# Altium schematic sheet OpAmpSupply.SchDoc
size Legal; CompanyName: Ploopy Corporation; Organization: Ploopy Corporation; Address1: Suite 226, 137-1140 Burnhamthorpe Road W; Address2: Mississauga; Address3: Ontario; Address4: Canada L5C 0A3; DocumentNumber: 7; Revision: R1.007; SheetNumber: 7; SheetTotal: 11
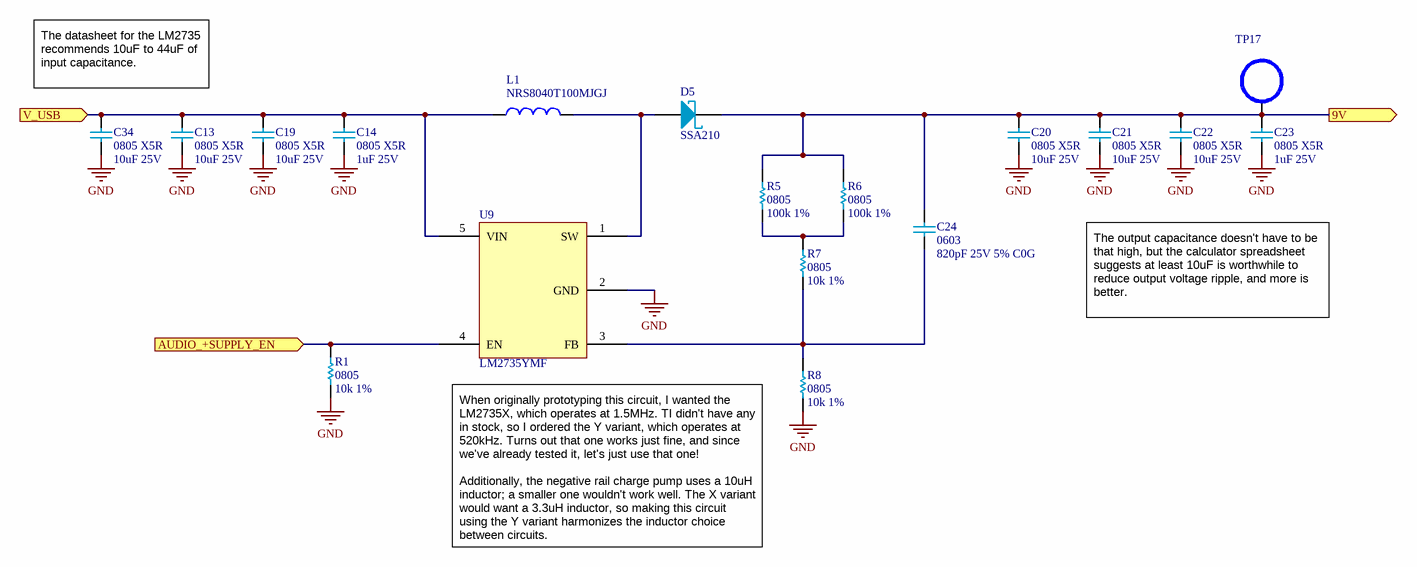
[diagram p0: OpAmpSupply.SchDoc]

## Parts
C13  0805 X5R  value 10uF 25V  [0805 - TALL]
C14  0805 X5R  value 1uF 25V  [0805 - TALL]
C19  0805 X5R  value 10uF 25V  [0805 - TALL]
C20  0805 X5R  value 10uF 25V  [0805 - TALL]
C21  0805 X5R  value 10uF 25V  [0805 - TALL]
C22  0805 X5R  value 10uF 25V  [0805 - TALL]
C23  0805 X5R  value 1uF 25V  [0805 - TALL]
C24  0603  value 820pF 25V 5% C0G  [0603]
C34  0805 X5R  value 10uF 25V  [0805 - TALL]
D5  SSA210  [SSA210 - DO-214AC]
L1  NRS8040T100MJGJ  [NRS8040T100MJGJ]
R1  0805  value 10k 1%  [0805]
R5  0805  value 100k 1%  [0805]
R6  0805  value 100k 1%  [0805]
R7  0805  value 10k 1%  [0805]
R8  0805  value 10k 1%  [0805]
TP17  TestPointHook  [S2751-46R]  (value not drawn)
U9  LM2735YMF  [LM2735XMF - SOT95P280X145-5M]

## Ports
9V (out), AUDIO_+SUPPLY_EN (in), V_USB (in)

## Nets
GND: C13.1 C14.1 C19.1 C20.1 C21.1 C22.1 C23.1 C34.1 R1.1 R8.1 U9.2(GND)
9V: C20.2 C21.2 C22.2 C23.2 C24.2 D5.1(C) R5.2 R6.2 TP17.1 ; port 9V
AUDIO_+SUPPLY_EN: R1.2 U9.4(EN) ; port AUDIO_+SUPPLY_EN
V_USB: C13.2 C14.2 C19.2 C34.2 L1.1 U9.5(VIN) ; port V_USB
NetC24_1: C24.1 R7.1 R8.2 U9.3(FB)
NetD5_2: D5.2 L1.2 U9.1(SW)
NetR5_1: R5.1 R6.1 R7.2

## Notes on the sheet
- The datasheet for the LM2735 recommends 10uF to 44uF of input capacitance.
- The output capacitance doesn't have to be that high, but the calculator spreadsheet suggests at least 10uF is worthwhile to reduce output voltage ripple, and more is better.
- When originally prototyping this circuit, I wanted the LM2735X, which operates at 1.5MHz. TI didn't have any in stock, so I ordered the Y variant, which operates at 520kHz. Turns out that one works just fine, and since we've already tested it, let's just use that one!
  Additionally, the negative rail charge pump uses a 10uH inductor; a smaller one wouldn't work well. The X variant would want a 3.3uH inductor, so making this circuit using the Y variant harmonizes the inductor choice between circuits.
- Copyright Ploopy Corporation 2023
- Licensed under the CERN-OHL-S v2
- http://ohwr.org/cernohl
- Title:
- PCB:
- Version:
- Ploopy Corporation
- Mississauga ON L5C 0A3
- 137-1140 Burnhamthorpe Road W
- Date:
- Time:
- Sheet
- of
- Canada

## Library data of the parts
C13 C19-C22 C34 = Cap 10uF 25V: 0805, X5R or better; Supplier 1: Mouser; Supplier Part Number 1: 81-GRM21BR61E106KA3L; Supplier 2: Digi-Key; Supplier Part Number 2: 490-5523-1-ND
C14 C23 = Cap 1uF 25V: 0805, X5R or better; Supplier 1: Digi-Key; Supplier Part Number 1: 1276-1066-2-ND; Supplier 2: Digi-Key; Supplier Part Number 2: 1276-1066-1-ND
C24 = Cap 820pF 25V: 0603, 5% C0G or better
D5 = SSA210: 100V 2A Shottky Diode (Rectifier); Supplier 1: Mouser; Supplier Part Number 1: 512-SSA210; Supplier 2: Digi-Key; Supplier Part Number 2: SSA210CT-ND
L1 = NRS8040T100MJGJ: FIXED IND 10UH 3.1A 44.2MOHM SMD
R1 R7 R8 = Res 10k 1% 0805: Chip resistor; Supplier 1: Digi-Key; Supplier Part Number 1: RMCF0805FT10K0TR-ND
R5 R6 = Res 100k 1% 0805: Chip resistor; Supplier 1: Digi-Key; Supplier 2: Digi-Key; Supplier Part Number 1: RMCF0805FT100KTR-ND; Supplier Part Number 2: RMCF0805FT100KCT-ND
TP17 = TestPointHook: Test point, SMT ring (micro-hook compatible); Supplier 1: Digi-Key; Supplier Part Number 1: 952-2664-6-ND; Supplier 2: Digi-Key; Supplier Part Number 2: A106144DKR-ND; Supplier 3: Arrow; Supplier Part Number 3: z_4zPAhGJpPHHYBcC24zmONEz5elv0VZALWfNkICq0w
U9 = LM2735YMF: LM2735 520-kHz Space-Efficient Boost and SEPIC DC/DC Regulator